# EAGLE design Schemat (EAGLE 8.1.1)
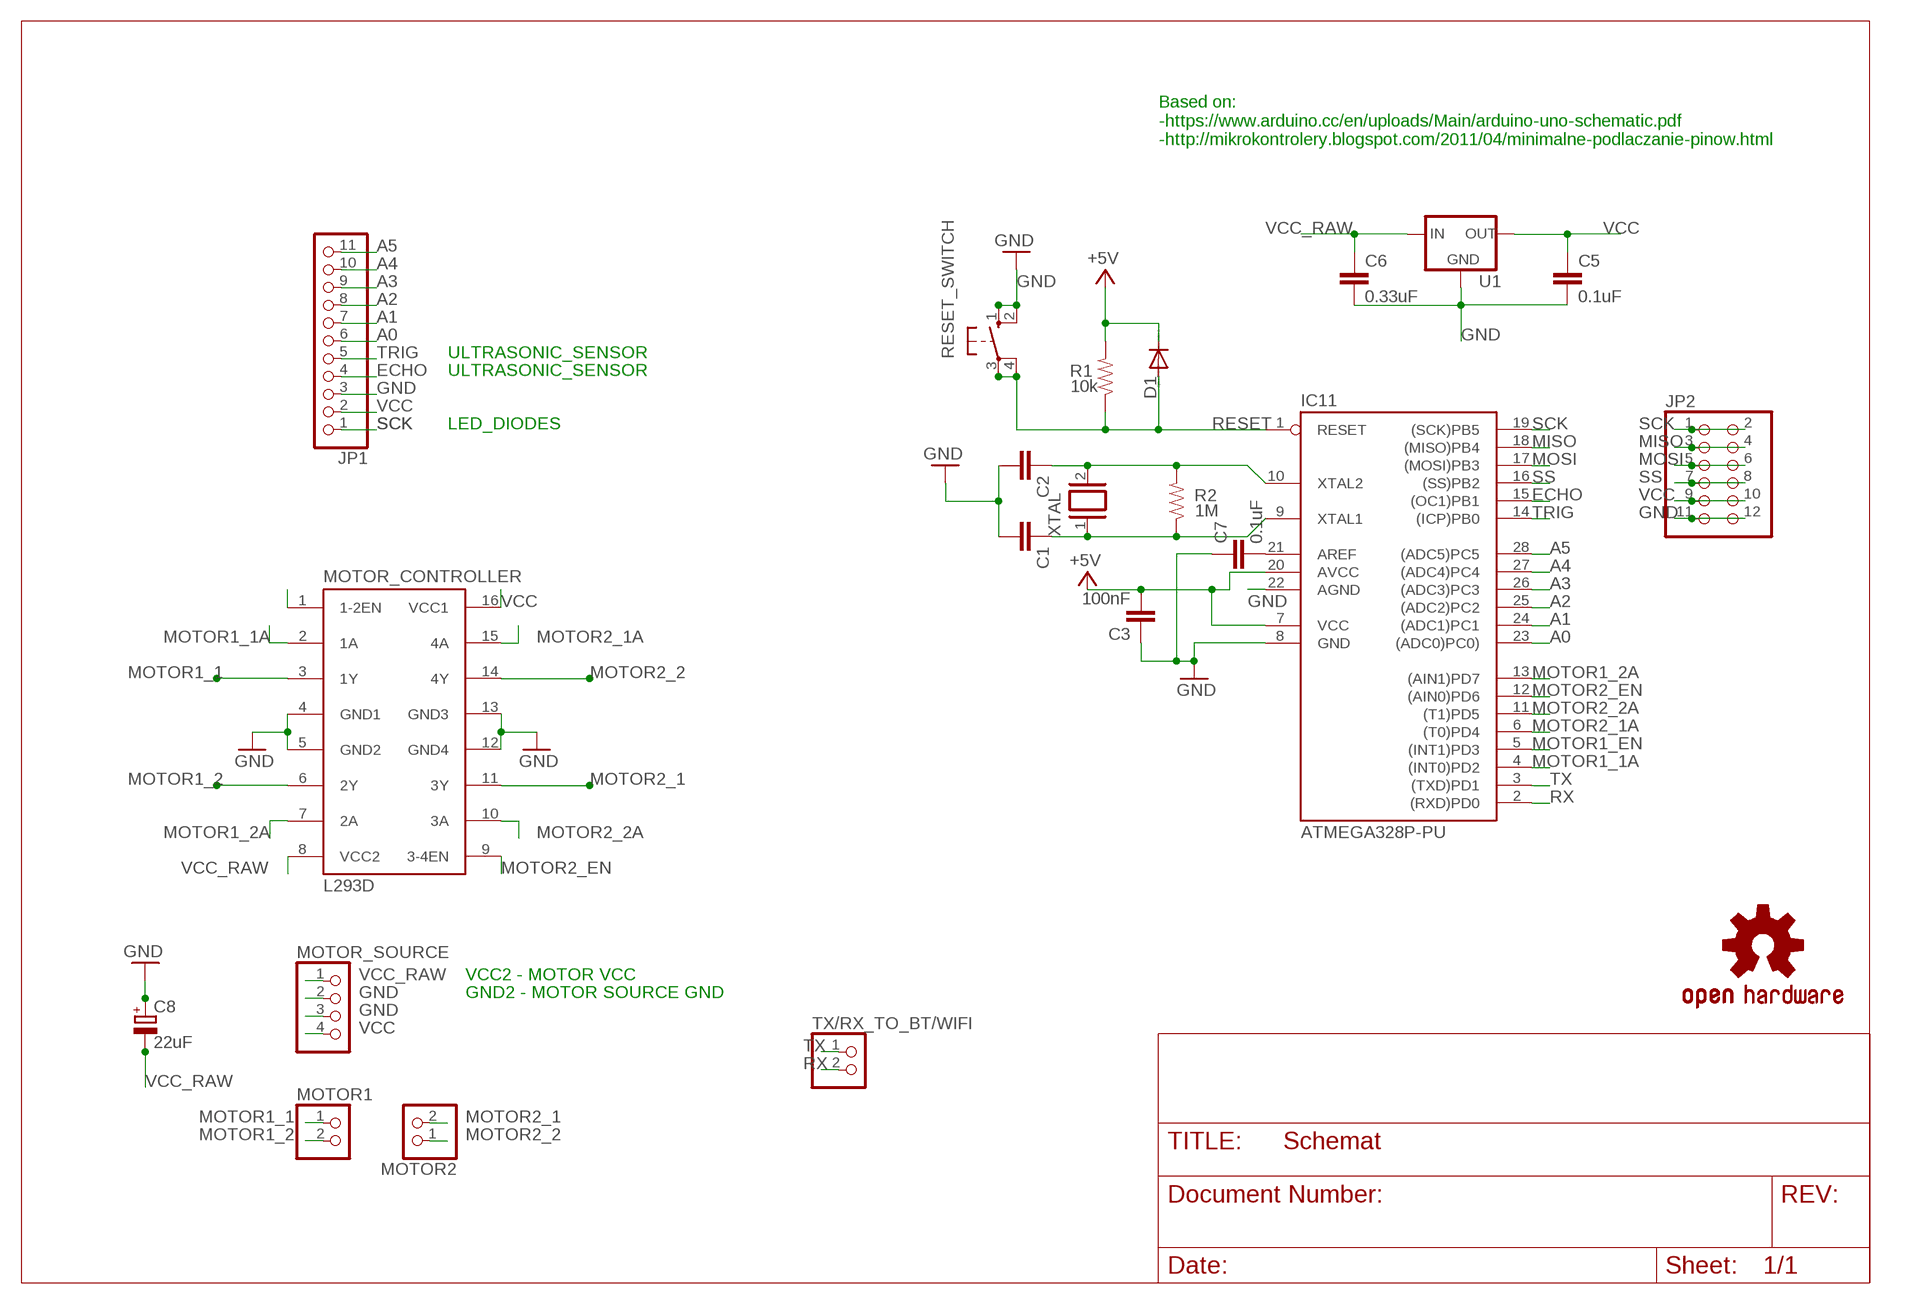
[diagram p0: schematic, sheet 1]

## Parts
C1  C-EU025-030X050  [C025-030X050]
C2  C-EU025-030X050  [C025-030X050]
C3  100nF  C-EU025-030X050  [C025-030X050]
C5  0.1uF  0.1UF-KIT-EZ-50V-20%  [CAP-PTH-SMALL-KIT]
C6  0.33uF  0.1UF-KIT-EZ-50V-20%  [CAP-PTH-SMALL-KIT]
C7  0.1uF  C-EU025-030X050  [C025-030X050]
C8  22uF  CPOL-EUE2,5-6E  [E2,5-6E]
D1  1N4004  [DO41-10]
IC11  ATMEGA328P-PU  [DIL28-3]
JP1  PINHD-1X11  [1X11]
JP2  PINHD-2X6  [2X06]
LOGO1  OSHW-LOGOS-COPPER  [OSHW-LOGO-S_COPPER]
MOTOR1  PINHD-1X2/90  [1X02/90]
MOTOR2  PINHD-1X2/90  [1X02/90]
MOTOR_CONTROLLER  L293D  [DIL16]
MOTOR_SOURCE  PINHD-1X4  [1X04]
R1  10k  RESISTORAXIAL-0.3  [AXIAL-0.3]
R2  1M  RESISTORAXIAL-0.3  [AXIAL-0.3]
RESET_SWITCH  10-XX  [B3F-10XX]
TX/RX_TO_BT/WIFI  PINHD-1X2/90  [1X02/90]
U1  V_REG_78XX-TO-220  [TO-220-ALT]
XTAL  XTAL/S  [QS]

## Nets
A0: IC11.23((ADC0)PC0)) JP1.6
A1: IC11.24((ADC1)PC1) JP1.7
A2: IC11.25((ADC2)PC2) JP1.8
A3: IC11.26((ADC3)PC3) JP1.9
A4: IC11.27((ADC4)PC4) JP1.10
A5: IC11.28((ADC5)PC5) JP1.11
ECHO: IC11.15((OC1)PB1) JP1.4
GND [GND]: C1.2 C2.2 C3.1 C5.2 C6.2 C7.1 C8.+ IC11.8(GND) IC11.22(AGND) JP1.3 JP2.11 JP2.12 MOTOR_CONTROLLER.4(GND1) MOTOR_CONTROLLER.5(GND2) MOTOR_CONTROLLER.12(GND4) MOTOR_CONTROLLER.13(GND3) MOTOR_SOURCE.2 MOTOR_SOURCE.3 RESET_SWITCH.1(S) RESET_SWITCH.2(S1) U1.GND
MISO: IC11.18((MISO)PB4) JP2.3 JP2.4
MOSI: IC11.17((MOSI)PB3) JP2.5 JP2.6
MOTOR1_1 [usbvcc]: MOTOR1.1 MOTOR_CONTROLLER.3(1Y)
MOTOR1_1A: IC11.4((INT0)PD2) MOTOR_CONTROLLER.2(1A)
MOTOR1_2 [usbvcc]: MOTOR1.2 MOTOR_CONTROLLER.6(2Y)
MOTOR1_2A: IC11.13((AIN1)PD7) MOTOR_CONTROLLER.7(2A)
MOTOR1_EN: IC11.5((INT1)PD3) MOTOR_CONTROLLER.1(1-2EN)
MOTOR2_1 [usbvcc]: MOTOR2.2 MOTOR_CONTROLLER.11(3Y)
MOTOR2_1A: IC11.6((T0)PD4) MOTOR_CONTROLLER.15(4A)
MOTOR2_2 [usbvcc]: MOTOR2.1 MOTOR_CONTROLLER.14(4Y)
MOTOR2_2A: IC11.11((T1)PD5) MOTOR_CONTROLLER.10(3A)
MOTOR2_EN: IC11.12((AIN0)PD6) MOTOR_CONTROLLER.9(3-4EN)
N$1: C2.1 IC11.10(XTAL2) R2.P$2 XTAL.2
N$3: C1.1 IC11.9(XTAL1) R2.P$1 XTAL.1
N$6: C7.2 IC11.21(AREF)
RESET: D1.A IC11.1(RESET) R1.P$1 RESET_SWITCH.3(P) RESET_SWITCH.4(P1)
RX: IC11.2((RXD)PD0) TX/RX_TO_BT/WIFI.2
SCK: IC11.19((SCK)PB5) JP1.1 JP2.1 JP2.2
SS: IC11.16((SS)PB2) JP2.7 JP2.8
TRIG: IC11.14((ICP)PB0) JP1.5
TX: IC11.3((TXD)PD1) TX/RX_TO_BT/WIFI.1
VCC: C3.2 C5.1 D1.C IC11.7(VCC) IC11.20(AVCC) JP1.2 JP2.9 JP2.10 MOTOR_CONTROLLER.16(VCC1) MOTOR_SOURCE.4 R1.P$2 U1.OUT ; supply symbol labelled +5V
VCC_RAW [usbvcc]: C6.1 C8.- MOTOR_CONTROLLER.8(VCC2) MOTOR_SOURCE.1 U1.IN

## Notes on the sheet
- Based on:
  -https://www.arduino.cc/en/uploads/Main/arduino-uno-schematic.pdf
  -http://mikrokontrolery.blogspot.com/2011/04/minimalne-podlaczanie-pinow.html
- ULTRASONIC_SENSOR
- ULTRASONIC_SENSOR
- LED_DIODES
- VCC2 - MOTOR VCC
- GND2 - MOTOR SOURCE GND

## Library data of the parts
C1-C3 C7 = rcl:C-EU: CAPACITOR, European symbol
C5 = SparkFun-Capacitors:0.1UF: 0.1µF ceramic capacitors A capacitor is a passive two-terminal electrical component used to store electrical energy temporarily in an electric field.; PROD_ID: CAP-08370
C6 = SparkFun-Capacitors:0.1UF: 0.1µF ceramic capacitors A capacitor is a passive two-terminal electrical component used to store electrical energy temporarily in an electric field.; PROD_ID: CAP-08370; VALUE: 0.1uF
C8 = rcl:CPOL-EU: POLARIZED CAPACITOR, European symbol
D1 = diode:1N4004: DIODE general purpose rectifier, 1 A
IC11 = SmartPrj:ATMEGA328P-: MICROCONTROLLER 4 Kbytes FLASH 128 bytes SRAM 256 bytes EEPROM UART 6-channel 10 bit ADC
JP1 = pinhead:PINHD-1X11: PIN HEADER
JP2 = pinhead:PINHD-2X6: PIN HEADER
LOGO1 = SparkFun-Aesthetics:OSHW-LOGO: Open-Source Hardware (OSHW) Logo This logo indicates the piece of hardware it is found on incorporates a OSHW license and/or adheres to the definition of open source hardware found here: http://freedomdefined.org/OSHW
MOTOR1 MOTOR2 TX/RX_TO_BT/WIFI = pinhead:PINHD-1X2: PIN HEADER
MOTOR_CONTROLLER = st-microelectronics:L293D: PUSH-PULL 4 CHANNEL DRIVER; MPN: L293D; OC_FARNELL: 9589619; OC_NEWARK: 56P8249
MOTOR_SOURCE = pinhead:PINHD-1X4: PIN HEADER
R1 R2 = SparkFun-Resistors:RESISTOR: Generic Resistor Package
RESET_SWITCH = switch-omron:10-XX: OMRON SWITCH; MPN: B3F-1000; OC_FARNELL: 176432; OC_NEWARK: 36M3542
U1 = SparkFun-IC-Power:V_REG_78XX: Voltage Regulator Standard 78xx regulator. IGO (Input Ground Output). Spark Fun Electronics SKU : COM-00107; PROD_ID: VREG-08450; SF_ID: COM-00107
XTAL = special:XTAL/S: CRYSTAL

## Net classes
0 default: width 0.254 mm, drill 0.61 mm, clearance 0.127 mm
2 GND: width 0.457 mm, drill 0.61 mm, clearance 0.127 mm
3 usbvcc: width 0.457 mm, drill 0.61 mm, clearance 0.127 mm

## Board
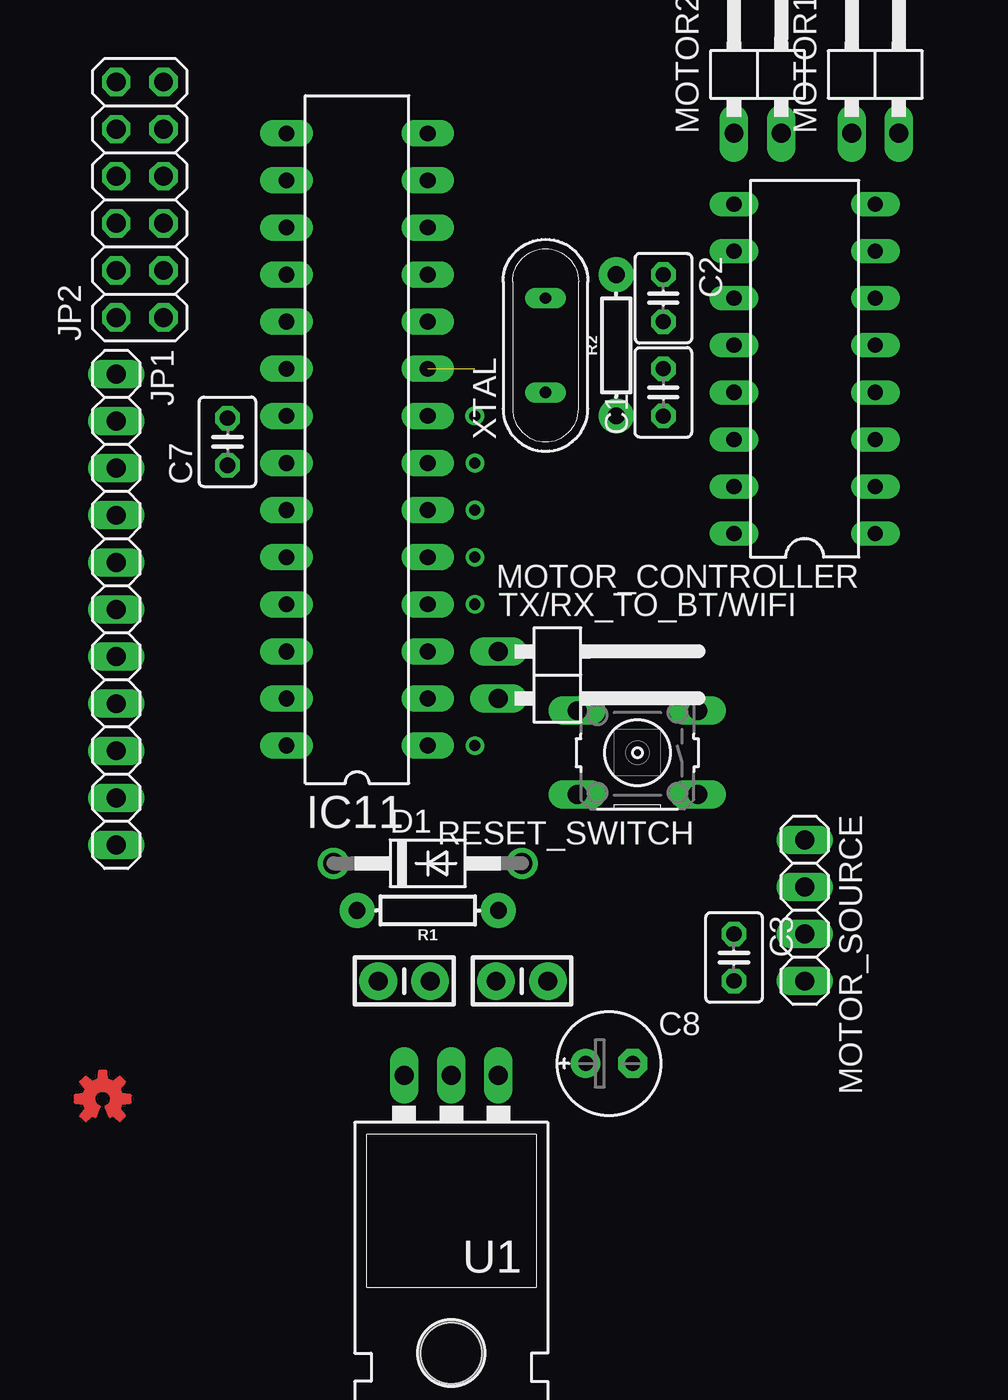
[diagram p1: board, top side]
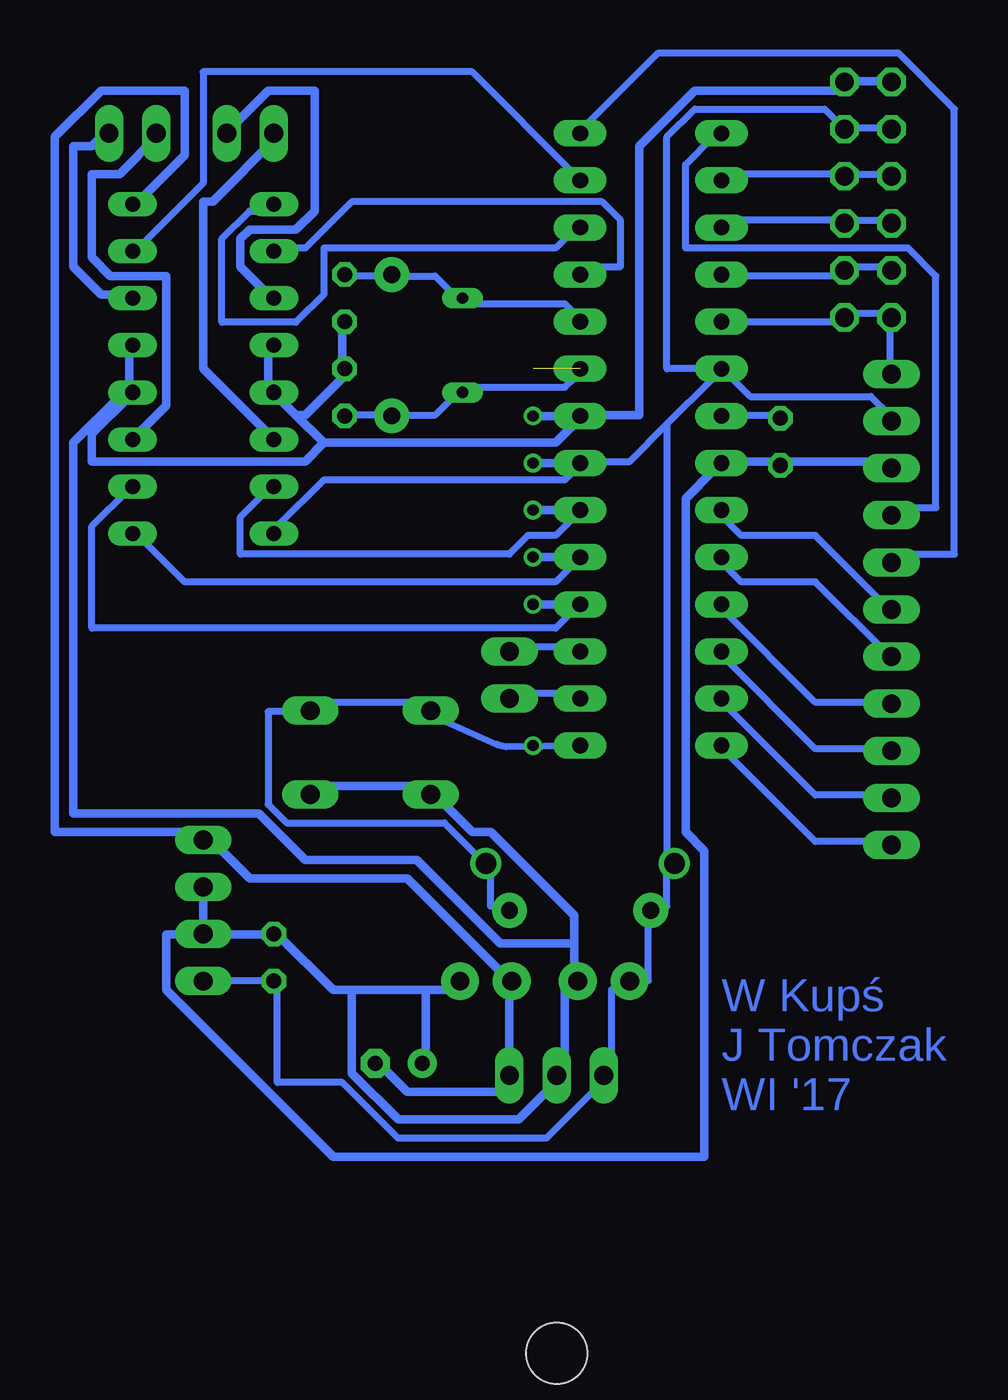
[diagram p2: board, bottom side, seen from below]

No outline drawn. Coordinates in mm, seen from the top.
Copper layers (1*16): Top 0.035mm / dielectric 1.5mm / Bottom 0.035mm
Design rules "default *": minimum track width 15mil, minimum drill 24mil, track to track 10mil, track to pad 8mil, pad to pad 8mil, via to via 8mil, smd to smd 8mil, copper to edge 40mil, drill to drill 8mil, minimum pad ring 10mil, minimum via ring 8mil, stop-mask expansion 4mil, vias tented up to drill 0mil, thermal gap 10mil

### Footprints (pad centres in the part's own frame; a part is rotated, then mirrored left to right if it is on the bottom)
C025-030X050 = drill 0.813 octagon: 1 -1.27,0; 2 1.27,0
CAP-PTH-SMALL-KIT = drill 1.016 pad 2.032: 1 -1.397,0; 2 1.397,0
E2,5-6E = drill 0.813 pad 1.575: + -1.27,0 | drill 0.813 pad 1.575 octagon: - 1.27,0
DO41-10 = drill 1.118: A 5.08,0; C -5.08,0
DIL28-3 = drill 0.85 pad 1.422 long: 1 -16.51,-3.81; 2 -13.97,-3.81; 3 -11.43,-3.81; 4 -8.89,-3.81; 5 -6.35,-3.81; 6 -3.81,-3.81; 7 -1.27,-3.81; 8 1.27,-3.81; 9 3.81,-3.81; 10 6.35,-3.81; 11 8.89,-3.81; 12 11.43,-3.81; 13 13.97,-3.81; 14 16.51,-3.81; 15 16.51,3.81; 16 13.97,3.81; 17 11.43,3.81; 18 8.89,3.81; 19 6.35,3.81; 20 3.81,3.81; 21 1.27,3.81; 22 -1.27,3.81; 23 -3.81,3.81; 24 -6.35,3.81; 25 -8.89,3.81; 26 -11.43,3.81; 27 -13.97,3.81; 28 -16.51,3.81
1X11 = drill 1.016 long: 1 -12.7,0; 2 -10.16,0; 3 -7.62,0; 4 -5.08,0; 5 -2.54,0; 6 0,0; 7 2.54,0; 8 5.08,0; 9 7.62,0; 10 10.16,0; 11 12.7,0
2X06 = drill 1.016 octagon: 1 -6.35,-1.27; 2 -6.35,1.27; 3 -3.81,-1.27; 4 -3.81,1.27; 5 -1.27,-1.27; 6 -1.27,1.27; 7 1.27,-1.27; 8 1.27,1.27; 9 3.81,-1.27; 10 3.81,1.27; 11 6.35,-1.27; 12 6.35,1.27
1X02/90 = drill 1.016 long: 1 -1.27,-3.81; 2 1.27,-3.81
DIL16 = drill 0.813 long: 1 -8.89,-3.81; 2 -6.35,-3.81; 3 -3.81,-3.81; 4 -1.27,-3.81; 5 1.27,-3.81; 6 3.81,-3.81; 7 6.35,-3.81; 8 8.89,-3.81; 9 8.89,3.81; 10 6.35,3.81; 11 3.81,3.81; 12 1.27,3.81; 13 -1.27,3.81; 14 -3.81,3.81; 15 -6.35,3.81; 16 -8.89,3.81
1X04 = drill 1.016 long: 1 -3.81,0; 2 -1.27,0; 3 1.27,0; 4 3.81,0
AXIAL-0.3 = drill 0.9 pad 1.88: P$1 -3.81,0; P$2 3.81,0
B3F-10XX = drill 1.016 long: 1 -3.251,2.261; 2 3.251,2.261; 3 -3.251,-2.261; 4 3.251,-2.261
TO-220-ALT = drill 1.016 long: GND 0,-3.81; IN -2.54,-3.81; OUT 2.54,-3.81 | hole 3.302: 0,11.176
QS = drill 0.61 long: 1 -2.54,0; 2 2.54,0

### Placement (x,y rotation side)
C1  55.88,45.72 90 top
C2  55.88,50.8 270 top
C3  59.69,15.24 270 top
C5  41.91,13.97 0 top
C6  48.26,13.97 0 top
C7  32.38,43.05 90 top
C8  52.96,9.53 0 top
D1  43.18,20.32 0 top
IC11  39.37,43.18 90 top
JP1  26.39,34.01 270 top
JP2  27.66,56.11 90 top
LOGO1  25.65,7.62 0 top
MOTOR1  67.31,63.5 0 top
MOTOR2  60.96,63.5 0 top
MOTOR_CONTROLLER  63.5,46.99 90 top
MOTOR_SOURCE  63.5,17.78 270 top
R1  43.18,17.78 180 top
R2  53.34,48.26 90 top
RESET_SWITCH  54.48,26.29 180 top
TX/RX_TO_BT/WIFI  50.8,30.48 270 top
U1  44.45,5.08 180 top
XTAL  49.53,48.26 90 top

### Tracks (layer width: path | path; a pad name or v marks a point on that pad's centre or on a via)
A0
  Bottom 0.381: IC11.23 35.5,39 34.5,38 30.5,38 27,34.5 26.5,34.5 JP1.6
A1
  Bottom 0.381: IC11.24 35.5,36.5 34.5,35.5 30.5,35.5 26.5,31.5 JP1.7
A2
  Bottom 0.381: IC11.25 35.5,34 30.5,29 26.5,29 JP1.8
A3
  Bottom 0.381: IC11.26 35.5,31.5 30.5,26.5 26.5,26.5 JP1.9
A4
  Bottom 0.381: IC11.27 35.5,29 30.5,24 26.5,24 JP1.10
A5
  Bottom 0.381: IC11.28 35.5,26.5 30.5,21.5 26.5,21.5 JP1.11
ECHO
  Bottom 0.381: IC11.15 36,59.5 37.5,58 37.5,53.5 25.5,53.5 24,52 24,39.5 26,39.5 JP1.4
GND
  Bottom 0.457: JP2.12 26.5,62.5 28.5,62.5 JP2.11 29,62 37,62 40,59 40,44.5 43,44.5 IC11.8 | MOTOR_CONTROLLER.5 67.5,48 67.5,46 MOTOR_CONTROLLER.4 67.5,45.5 | C2.2 56,49.5 56,47 C1.2 56,46.5 58,44.5 58.5,44.5 | MOTOR_CONTROLLER.12 60,48 60,46 MOTOR_CONTROLLER.13 59.5,45.5 58.5,44.5 | 57,43 44.5,43 43.5,44 IC11.8 | 58.5,44.5 57,43 | 67.5,45.5 69.5,43.5 69.5,42 58,42 57,43 | RESET_SWITCH.1 57.5,24.5 51.5,24.5 RESET_SWITCH.2 51,24 49,22 48,22 43.5,17.5 43.5,16 | 43.5,16 43.5,14 C5.2 43.5,13.5 44,13.5 44,9 U1.GND 44.5,8.5 46.5,6.5 53,6.5 55.5,9 55.5,13.5 | JP1.3 26.5,42 32,42 C7.1 32.5,42 35.5,42 IC11.22 36,41.5 37.5,40 37.5,22 36.5,21 36.5,4.5 56.5,4.5 65.5,13.5 65.5,16.5 MOTOR_SOURCE.3 | MOTOR_SOURCE.3 60,16.5 C3.1 59.5,16.5 56.5,13.5 55.5,13.5 | MOTOR_SOURCE.2 MOTOR_SOURCE.3 | 51.5,13.5 51.5,10 C8.+ | 51.5,13.5 50,13.5 C6.2 | 51.5,13.5 55.5,13.5 | 67.5,45.5 68,45.5 70.5,43 70.5,23 60.5,23 58,20.5 52,20.5 47.5,16 43.5,16 | IC11.8 45.72,44.45
MISO
  Bottom 0.381: IC11.18 35.5,52 29,52 JP2.3 28.5,52.5 26.5,52.5 JP2.4
MOSI
  Bottom 0.381: IC11.17 35.5,55 29,55 JP2.5 28.5,55 26.5,55 JP2.6
MOTOR1_1
  Bottom 0.457: MOTOR_CONTROLLER.3 67,43.5 65.5,45 65.5,52 68.5,52 69.5,53 69.5,57.5 68,57.5 66,59.5 MOTOR1.1
MOTOR1_1A
  Bottom 0.381: MOTOR_CONTROLLER.2 67.5,40.5 69.5,38.5 69.5,33 44.5,33 43.5,34 IC11.4
  Bottom 0.457: IC11.4 45.72,34.29
MOTOR1_2
  Bottom 0.457: MOTOR_CONTROLLER.6 67.5,51 69,51 70.5,52.5 70.5,59 69.5,59 69,59.5 MOTOR1.2
MOTOR1_2A
  Bottom 0.381: MOTOR_CONTROLLER.7 67,53.5 63.5,57 63.5,63 49,63 43.5,57.5 IC11.13
MOTOR1_EN
  Bottom 0.381: MOTOR_CONTROLLER.1 67,38 64.5,35.5 44.5,35.5 43.5,36.5 IC11.5
  Bottom 0.457: IC11.5 45.85,36.83
MOTOR2_1
  Bottom 0.457: MOTOR_CONTROLLER.11 60,51 61.5,52.5 61.5,54 61,54.5 58.5,54.5 57.5,55.5 57.5,62 60,62 62,60 MOTOR2.2
MOTOR2_1A
  Bottom 0.381: MOTOR_CONTROLLER.15 60,40.5 61.5,39 61.5,37 47,37 46,38 44.5,38 43.5,39 IC11.6
  Bottom 0.457: IC11.6 45.72,39.37
MOTOR2_2
  Bottom 0.457: MOTOR_CONTROLLER.14 60,43.5 63.5,47 63.5,56 63,56 59.5,59.5 MOTOR2.1
MOTOR2_2A
  Bottom 0.381: MOTOR_CONTROLLER.10 59.5,53.5 58,53.5 55.5,56 42,56 41,55 41,52.5 43,52.5 IC11.11
MOTOR2_EN
  Bottom 0.381: MOTOR_CONTROLLER.9 60,55.5 61,55.5 62.5,54 62.5,49.5 58.5,49.5 57,51 57,53.5 44.5,53.5 43.5,54.5 IC11.12
N$1
  Bottom 0.381: C2.1 55.5,52 53.5,52 R2.P$2 53,52 51,52 50,51 XTAL.2 49.5,50.5 44,50.5 43.5,50 IC11.10
N$2  (via drill 0.6)
  other vias: 45.72,36.83
N$3  (1 unrouted)
  Bottom 0.381: C1.1 55.5,44.5 53.5,44.5 R2.P$1 53,44.5 51,44.5 50,45.5 XTAL.1 49.5,46 44,46 43.5,46.5 IC11.9
N$4  (via drill 0.6)
  other vias: 45.72,39.37
N$5  (via drill 0.6)
  other vias: 45.72,41.91
N$6
  Bottom 0.381: C7.2 32.5,44.5 35.5,44.5 IC11.21
N$9  (via drill 0.6)
  other vias: 45.72,34.29
N$10  (via drill 0.6)
  other vias: 45.72,26.67
N$14  (via drill 0.6 pad 1.02)
  other vias: 45.72,44.45
RESET
  Bottom 0.381: R1.P$1 47,18 48,18 48,20 D1.A 48.5,20.5 50.5,22.5 59,22.5 60,23.5 60,28.5 58,28.5 RESET_SWITCH.3 57.5,29 51.5,29 RESET_SWITCH.4 51,28.5 50.5,28 47.67,26.73 47.18,26.62 IC11.1
RX
  Bottom 0.381: IC11.2 43.5,29.5 46.5,29.5 TX/RX_TO_BT/WIFI.2
SCK
  Bottom 0.381: JP1.1 26.5,47 26.5,49.5 JP2.2 26.5,50 28.5,50 JP2.1 29,49.5 35.5,49.5 IC11.19
SS
  Bottom 0.381: IC11.16 35.5,57.5 29,57.5 JP2.7 28.5,57.5 26.5,57.5 JP2.8
TRIG
  Bottom 0.381: IC11.14 43,60 39,64 26,64 23,61 23,37 26,37 JP1.5
TX
  Bottom 0.381: IC11.3 43.5,32 46.5,32 TX/RX_TO_BT/WIFI.1
VCC
  Bottom 0.381: MOTOR_SOURCE.4 63.5,14 60,14 C3.2 59.5,13.5 59.5,8.5 56,8.5 53,5.5 45,5.5 42,8.5 U1.OUT 41.5,9 41.5,13.5 41,13.5 C5.1 40.5,14 39.5,14 39.5,17.5 R1.P$2 39,18 38.5,18 38.5,20 D1.C 38.5,20.5 38.5,44 | JP2.10 26.5,60 28.5,60 JP2.9 29,60 30,61 37,61 38.5,59.5 38.5,47 36,47 IC11.20 | MOTOR_CONTROLLER.16 59.5,38.5 57,41 44,41 43.5,41.5 IC11.7 43,42 40.5,42 38.5,44 | 38.5,44 36,46.5 IC11.20 | JP1.2 26.5,44.5 27.5,45.5 34,45.5 35,46.5 35.5,46.5 IC11.20
  Bottom 0.457: IC11.7 45.72,41.91
VCC_RAW
  Bottom 0.457: C8.- 54,9.5 52.5,8 47.5,8 47,8.5 U1.IN 47,9 47,13.5 C6.1 47,14 52.5,19.5 61,19.5 63,21.5 63.5,21.5 MOTOR_SOURCE.1 63.5,22 71.5,22 71.5,59.5 69,62 64.5,62 64.5,58.5 67,56 MOTOR_CONTROLLER.8

### Text on the board
Bottom: W Kupś / J Tomczak / WI '17